# EAGLE design RedBot_Buzzer (EAGLE 6.4)
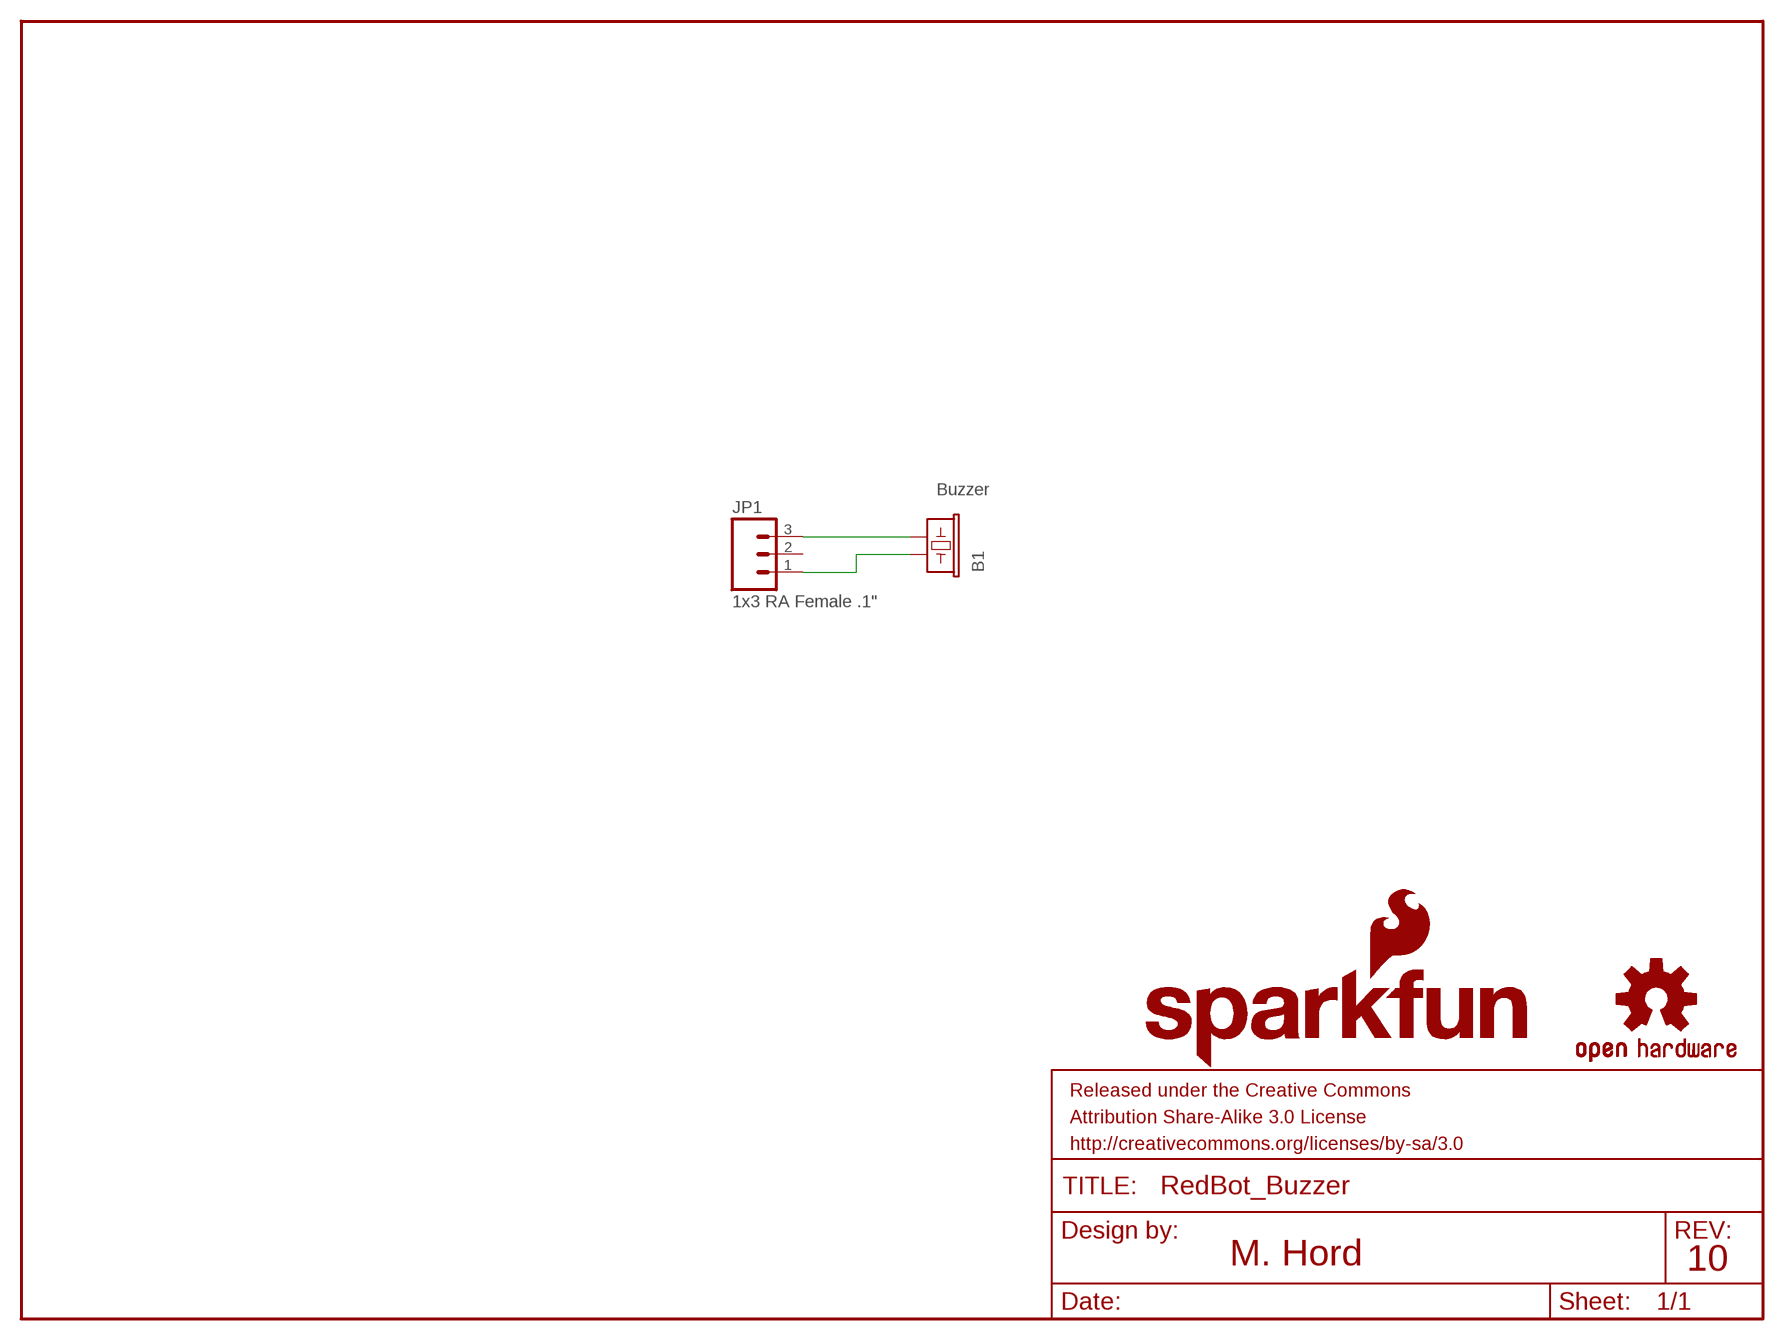
[diagram p0: schematic, sheet 1]

## Parts
B1  Buzzer  BUZZERSMD2  [BUZZER-CCV]
FRAME1  FRAME-LETTER  [CREATIVE_COMMONS]
JP1  1x3 RA Female .1"  M03SMD_RA_FEMALE  [1X03_SMD_RA_FEMALE]
LOGO1  OSHW-LOGOS  [OSHW-LOGO-S]
LOGO2  SFE_LOGO_NAME_FLAME.1_INCH  [SFE_LOGO_NAME_FLAME_.1]

## Nets
N$1: B1.+ JP1.1
N$2: B1.- JP1.3
Unconnected: JP1.2

## Notes on the sheet
- M. Hord | 10

## Library data of the parts
B1 = SparkFun:BUZZER: Buzzer 12mm Spark Fun Electronics SKU : Comp-Buzzer
FRAME1 = SparkFun-Aesthetics:FRAME-LETTER: Schematic Frame Standard 8.5x11 US Letter frame
JP1 = SparkFun-Connectors:M03: Header 3 Standard 3-pin 0.1" header. Use with straight break away headers (SKU : PRT-00116), right angle break away headers (PRT-00553), swiss pins (PRT-00743), machine pins (PRT-00117), and female headers (PRT-00115). Molex polarized connector foot print use with SKU : PRT-08232 with associated crimp pins and housings.; PROD_ID: CONN-10926
LOGO1 = SparkFun-Aesthetics:OSHW-LOGO: Open Source Hardware Logo This logo indicates the piece of hardware it is found on incorporates a OSHW license and/or adheres to the definition of open source hardware found here: http://freedomdefined.org/OSHW
LOGO2 = SparkFun-Aesthetics:SFE_LOGO_NAME_FLAME: SFE Logo, name and flame This is the SparkFun full logo. The logo on the schematic will always be the same size; the package variant is the height of the flame part of the logo. Default layer for the logo on the board is tSilk.

## Board
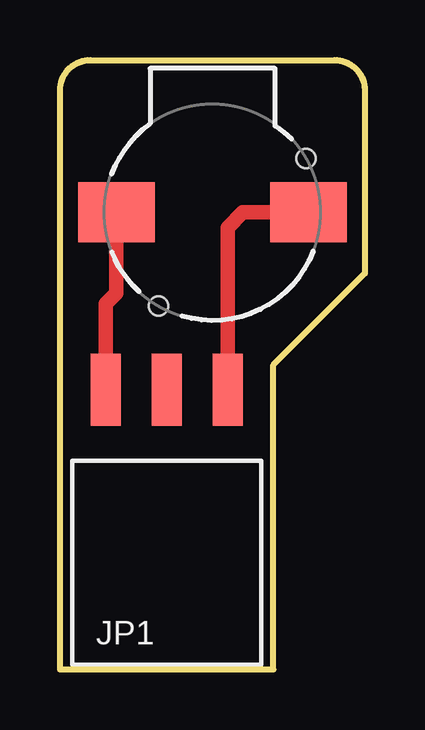
[diagram p1: board, top side]
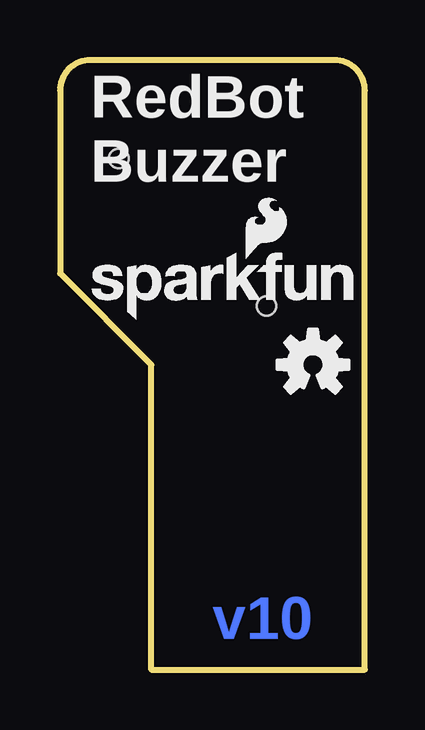
[diagram p2: board, bottom side, seen from below]

Size 12.7 x 25.4 mm. Coordinates in mm from the lower left corner, seen from the top.
Outline: 0,0 0,24.13 arc-90 1.27,25.4 11.43,25.4 arc-90 12.7,24.13 12.7,16.51 8.89,12.7 8.89,0 0,0
Copper layers (1*16): Top 0.035mm / dielectric 1.5mm / Bottom 0.035mm
Design rules "SparkFun": minimum track width 8mil, minimum drill 20mil, track to track 8mil, track to pad 8mil, pad to pad 8mil, via to via 8mil, smd to smd 8mil, copper to edge 8mil, drill to drill 8mil, minimum pad ring 12mil, minimum via ring 10mil, stop-mask expansion 4mil, vias tented up to drill 20mil, thermal gap 10mil

### Footprints (pad centres in the part's own frame; a part is rotated, then mirrored left to right if it is on the bottom)
BUZZER-CCV = smd 3.2 x 2.5: + 4,0; - -4,0 | hole 0.8: -3.9,-2.25; 2.25,3.9
1X03_SMD_RA_FEMALE = smd 1.25 x 3: 1 -2.54,7.225; 2 0,7.225; 3 2.54,7.225

### Placement (x,y rotation side)
B1  6.35,19.05 180 top
FRAME1  2.54,-15.24 0 top  (outside the outline)
JP1  4.45,4.45 0 top
LOGO1  2.16,12.7 0 bottom
LOGO2  11.81,14.48 0 bottom

### Tracks (layer width: path | path; a pad name or v marks a point on that pad's centre or on a via)
N$1
  Top 0.61: B1.+ 2.35,15.69 1.91,15.24 JP1.1
N$2
  Top 0.61: JP1.3 6.99,18.41 7.62,19.05 B1.-

### Text on the board
Bottom: v10
bPlace: RedBot / Buzzer
tDocu: M. Hord